# Altium schematic sheet 01 - Overview.SchDoc
size A4; SheetNumber: 1; SheetTotal: 4; SchemaTitle: Overview
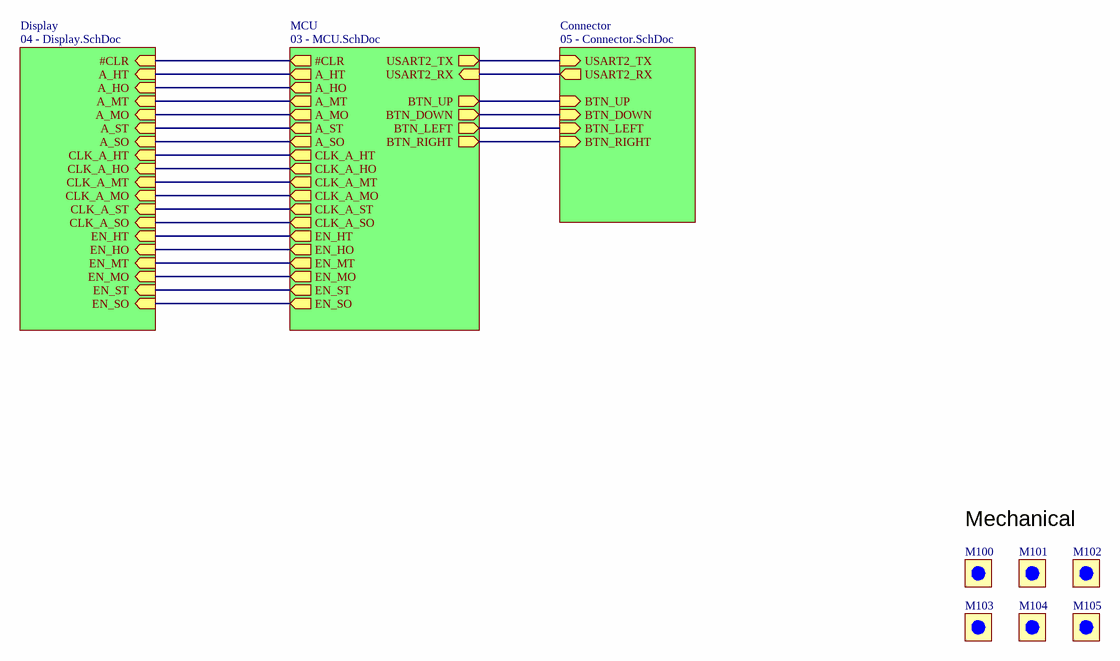
[diagram p0: 01 - Overview.SchDoc]

## Parts
M100  Fiducial Round  [Fiducial round_small]  (value not drawn)  (no BOM)
M101  Fiducial Round  [Fiducial round_small]  (value not drawn)  (no BOM)
M102  Fiducial Round  [Fiducial round_small]  (value not drawn)  (no BOM)
M103  Fiducial Round  [Fiducial round_small]  (value not drawn)  (no BOM)
M104  Fiducial Round  [Fiducial round_small]  (value not drawn)  (no BOM)
M105  Fiducial Round  [Fiducial round_small]  (value not drawn)  (no BOM)

## Sub-sheets
Connector = 05 - Connector.SchDoc: USART2_RX (out), USART2_TX (in), BTN_UP (in), BTN_DOWN (in), BTN_LEFT (in), BTN_RIGHT (in)
Display = 04 - Display.SchDoc: #CLR (in), A_HT (in), A_HO (in), A_MO (in), A_SO (in), A_MT (in), A_ST (in), CLK_A_HT (in), CLK_A_HO (in), CLK_A_MT (in), CLK_A_MO (in), CLK_A_ST (in), CLK_A_SO (in), EN_HT (in), EN_HO (in), EN_MT (in), EN_MO (in), EN_ST (in), EN_SO (in)
MCU = 03 - MCU.SchDoc: #CLR (out), A_HT (out), A_HO (out), A_MT (out), A_MO (out), A_ST (out), A_SO (out), USART2_TX (out), USART2_RX (in), BTN_UP (out), BTN_DOWN (out), BTN_LEFT (out), BTN_RIGHT (out), CLK_A_HT (out), CLK_A_HO (out), CLK_A_MT (out), CLK_A_MO (out), CLK_A_ST (out), CLK_A_SO (out), EN_HT (out), EN_HO (out), EN_MT (out), EN_MO (out), EN_ST (out), EN_SO (out)

## Nets
(unnamed): sheet Display/#CLR, sheet MCU/#CLR
(unnamed): sheet Display/A_HT, sheet MCU/A_HT
(unnamed): sheet Display/A_HO, sheet MCU/A_HO
(unnamed): sheet Display/A_MO, sheet MCU/A_MO
(unnamed): sheet Display/A_SO, sheet MCU/A_SO
(unnamed): sheet Display/A_MT, sheet MCU/A_MT
(unnamed): sheet Display/A_ST, sheet MCU/A_ST
(unnamed): sheet Display/CLK_A_HT, sheet MCU/CLK_A_HT
(unnamed): sheet Display/CLK_A_HO, sheet MCU/CLK_A_HO
(unnamed): sheet Display/CLK_A_MT, sheet MCU/CLK_A_MT
(unnamed): sheet Display/CLK_A_MO, sheet MCU/CLK_A_MO
(unnamed): sheet Display/CLK_A_ST, sheet MCU/CLK_A_ST
(unnamed): sheet Display/CLK_A_SO, sheet MCU/CLK_A_SO
(unnamed): sheet Display/EN_HT, sheet MCU/EN_HT
(unnamed): sheet Display/EN_HO, sheet MCU/EN_HO
(unnamed): sheet Display/EN_MT, sheet MCU/EN_MT
(unnamed): sheet Display/EN_MO, sheet MCU/EN_MO
(unnamed): sheet Display/EN_ST, sheet MCU/EN_ST
(unnamed): sheet Display/EN_SO, sheet MCU/EN_SO
(unnamed): sheet MCU/USART2_TX, sheet Connector/USART2_TX
(unnamed): sheet MCU/USART2_RX, sheet Connector/USART2_RX
(unnamed): sheet MCU/BTN_UP, sheet Connector/BTN_UP
(unnamed): sheet MCU/BTN_DOWN, sheet Connector/BTN_DOWN
(unnamed): sheet MCU/BTN_LEFT, sheet Connector/BTN_LEFT
(unnamed): sheet MCU/BTN_RIGHT, sheet Connector/BTN_RIGHT

## Notes on the sheet
- Mechanical
- Schema Title:
- Project:
- Revision:
- Author:
- PCB Name:
- Date:
- Time:
- Sheet:
- of
- Doc Name:
- A4

## Library data of the parts
M100-M105 = Fiducial Round-11: Fiducial (Optical Marker)